# EAGLE design Root1 Interfaces Test (EAGLE 6.4)
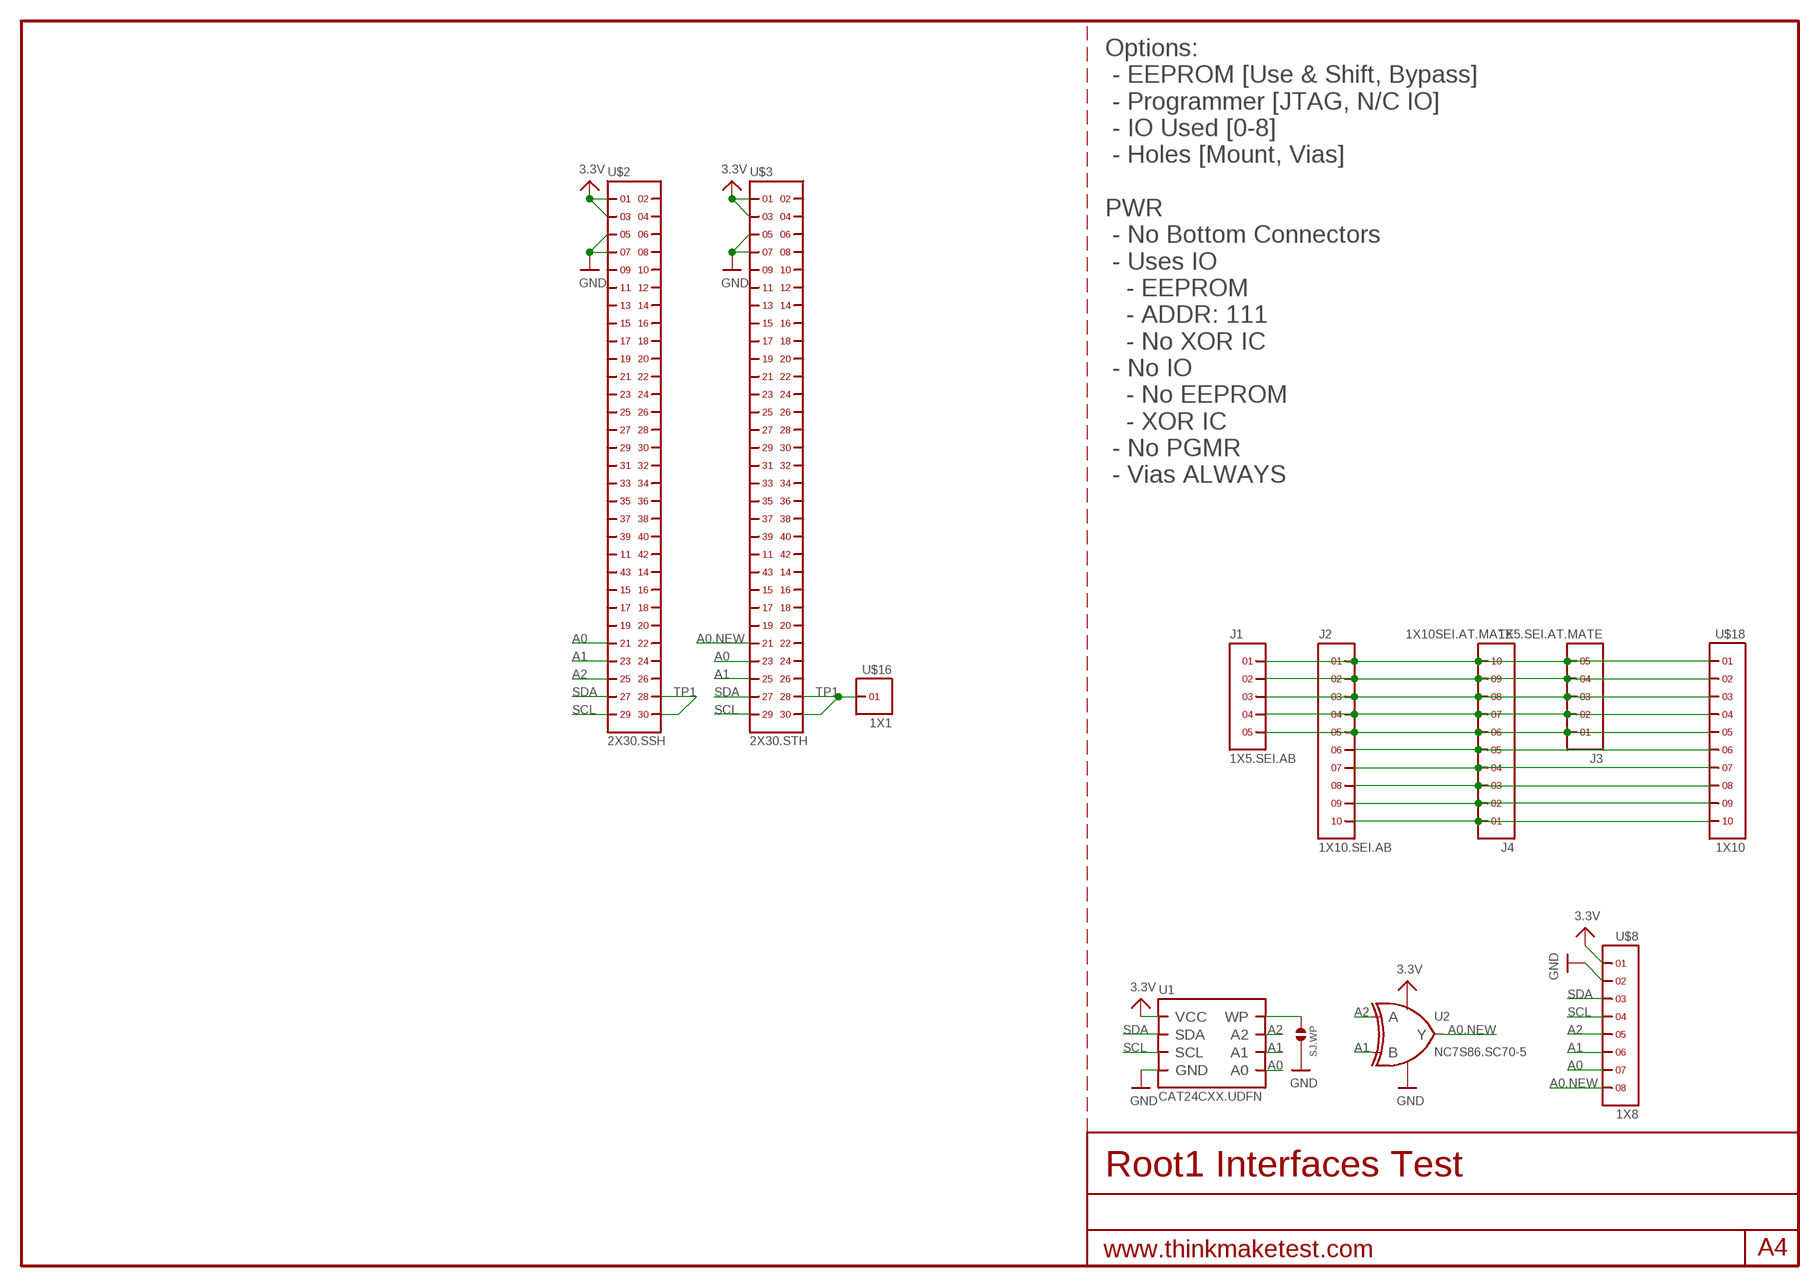
[diagram p0: schematic, sheet 1]

## Parts
J1  1X5.SEI.AB  [SEI-105-02-XX-S-X-AB]
J2  1X10.SEI.AB  [SEI-110-02-XX-S-X-AB]
J3  1X5.SEI.AT.MATE  [SEI-105-02-XX-S-AT.MATE]
J4  1X10SEI.AT.MATE  [SEI-110-02-XX-S-X-AT.MATE]
SJ.WP  SOLDERJUMPER.2.MED  [2.MED]
U1  CAT24CXX.UDFN  [UDFN8.2X3MM]
U2  NC7S86.SC70-5  [SC70-5]
U$2  2X30.SSH  [SSH-030-X.XX-X-D-A]
U$3  2X30.STH  [STH-030-X.XX-X-D-A]
U$8  1X8  [1X8]
U$16  1X1  [1X1]
U$18  1X10  [1X10]

## Nets
1: J1.1 J2.1 J3.5 J4.10 U$18.1
2: J1.2 J2.2 J3.4 J4.9 U$18.2
3: J1.3 J2.3 J3.3 J4.8 U$18.3
3.3V: U1.8(VCC) U2.6(VCC) U$2.1 U$2.3 U$3.1 U$3.3 U$8.1
4: J1.4 J2.4 J3.2 J4.7 U$18.4
5: J1.5 J2.5 J3.1 J4.6 U$18.5
6: J2.6 J4.5 U$18.6
7: J2.7 J4.4 U$18.7
8: J2.8 J4.3 U$18.8
9: J2.9 J4.2 U$18.9
10: J2.10 J4.1 U$18.10
A0: U1.1(A0) U$2.51 U$3.53 U$8.7
A0.NEW: U2.4(Y) U$3.51 U$8.8
A1: U1.2(A1) U2.2(B) U$2.53 U$3.55 U$8.6
A2: U1.3(A2) U2.1(A) U$2.55 U$8.5
GND: SJ.WP.2 U1.4(GND) U1.PAD(GND) U2.3(GND) U$2.5 U$2.7 U$3.5 U$3.7 U$8.2
N$1: SJ.WP.1 U1.7(WP)
SCL: U1.6(SCL) U$2.59 U$3.59 U$8.4
SDA: U1.5(SDA) U$2.57 U$3.57 U$8.3
TP1: U$2.58 U$2.60 U$3.58 U$3.60 U$16.1
Unconnected: U$2.2 U$2.4 U$2.6 U$2.8 U$2.9 U$2.10 U$2.11 U$2.12 U$2.13 U$2.14 U$2.15 U$2.16 U$2.17 U$2.18 U$2.19 U$2.20 U$2.21 U$2.22 U$2.23 U$2.24 U$2.25 U$2.26 U$2.27 U$2.28 U$2.29 U$2.30 U$2.31 U$2.32 U$2.33 U$2.34 U$2.35 U$2.36 U$2.37 U$2.38 U$2.39 U$2.40 U$2.41 U$2.42 U$2.43 U$2.44 U$2.45 U$2.46 U$2.47 U$2.48 U$2.49 U$2.50 U$2.52 U$2.54 U$2.56 U$3.2 U$3.4 U$3.6 U$3.8 U$3.9 U$3.10 U$3.11 U$3.12 U$3.13 U$3.14 U$3.15 U$3.16 U$3.17 U$3.18 U$3.19 U$3.20 U$3.21 U$3.22 U$3.23 U$3.24 U$3.25 U$3.26 U$3.27 U$3.28 U$3.29 U$3.30 U$3.31 U$3.32 U$3.33 U$3.34 U$3.35 U$3.36 U$3.37 U$3.38 U$3.39 U$3.40 U$3.41 U$3.42 U$3.43 U$3.44 U$3.45 U$3.46 U$3.47 U$3.48 U$3.49 U$3.50 U$3.52 U$3.54 U$3.56

## Notes on the sheet
- Options:
   - EEPROM [Use & Shift, Bypass]
   - Programmer [JTAG, N/C IO]
   - IO Used [0-8]
   - Holes [Mount, Vias]
- PWR
   - No Bottom Connectors
   - Uses IO
     - EEPROM
     - ADDR: 111
     - No XOR IC
   - No IO
     - No EEPROM
     - XOR IC
   - No PGMR
   - Vias ALWAYS

## Library data of the parts
J1 J3 = headers(1mm)(samtec):1X5
J2 J4 = headers(1mm)(samtec):1X10
SJ.WP = solderjumper:SOLDERJUMPER.2
U1 = on-semiconductor:CAT24CXX
U2 = fairchild:NC7S86
U$2 U$3 = headers(.5mm)(samtec):2X30
U$8 = headers(2mm)(samtec):1X8
U$16 = headers(2mm)(samtec):1X1
U$18 = headers(.1in):1X10

## Board
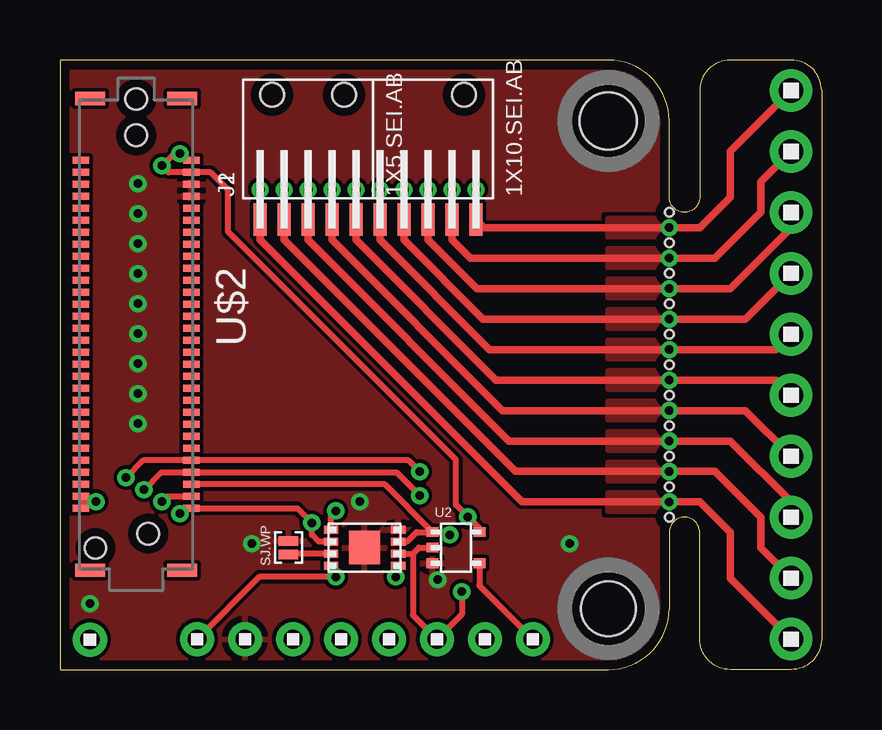
[diagram p1: board, top side]
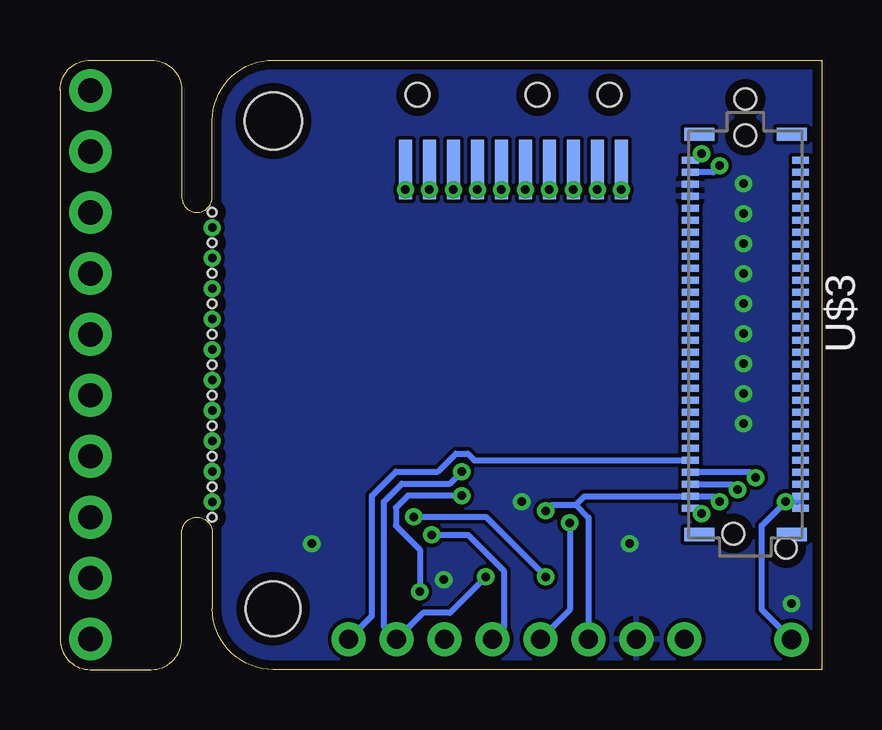
[diagram p2: board, bottom side, seen from below]

Size 31.75 x 25.4 mm. Coordinates in mm from the lower left corner, seen from the top.
Outline: 0,0 22.86,0 arc90 25.4,2.54 25.4,5.71 arc-90 26.04,6.35 arc-90 26.67,5.71 26.67,1.27 arc90 27.94,0 30.48,0 arc90 31.75,1.27 31.75,24.13 arc90 30.48,25.4 27.94,25.4 arc90 26.67,24.13 26.67,19.68 arc-90 26.04,19.05 arc-90 25.4,19.68 25.4,22.86 arc90 22.86,25.4 0,25.4 0,0
Copper layers (1*16): Top 0.0356mm / dielectric 1.5011mm / Bottom 0.0356mm
Design rules "OSHPark": minimum track width 6mil, minimum drill 13mil, track to track 6mil, track to pad 6mil, pad to pad 6mil, via to via 6mil, smd to smd 6mil, copper to edge 15mil, drill to drill 6mil, minimum pad ring 7mil, minimum via ring 7mil, stop-mask expansion 0mil, vias tented up to drill 16mil, thermal gap 10mil
Holes 2.29 mm at 22.86,2.54
Holes 2.39 mm at 22.86,22.86
Holes 0.36 mm at 25.4,8.89 25.4,7.62 25.4,6.35 25.4,10.16 25.4,11.43 25.4,12.7 25.4,13.97 25.4,15.24 25.4,16.51 25.4,17.78 25.4,19.05

### Footprints (pad centres in the part's own frame; a part is rotated, then mirrored left to right if it is on the bottom)
SEI-105-02-XX-S-X-AB = smd 0.559 x 1.346: 1 -2,-0.88; 2 -1,-0.88; 3 0,-0.879; 4 1,-0.88; 5 2,-0.88 | hole 0.99: -1.5,4.32; 1.5,4.32
SEI-110-02-XX-S-X-AB = smd 0.559 x 1.346: 1 -4.5,-0.88; 2 -3.5,-0.88; 3 -2.5,-0.879; 4 -1.5,-0.88; 5 -0.5,-0.88; 6 0.5,-0.88; 7 1.5,-0.88; 8 2.5,-0.879; 9 3.5,-0.88; 10 4.5,-0.88 | hole 0.99: -4,4.32; 4,4.32
SEI-105-02-XX-S-AT.MATE = smd 0.56 x 2.477: 1 -2,1.2; 2 -1,1.2; 3 0,1.2; 4 1,1.2; 5 2,1.2 | hole 0.99: -1.5,4.32; 1.5,4.32
SEI-110-02-XX-S-X-AT.MATE = smd 0.56 x 2.477: 1 -4.5,1.2; 2 -3.5,1.2; 3 -2.5,1.2; 4 -1.5,1.2; 5 -0.5,1.2; 6 0.5,1.2; 7 1.5,1.2; 8 2.5,1.2; 9 3.5,1.2; 10 4.5,1.2 | hole 0.99: -4,4.32; 4,4.32
2.MED = smd 0.406 x 0.813: 1 -0.279,0; 2 0.279,0
UDFN8.2X3MM = smd 0.32 x 0.6: 1 -0.75,-1.4; 2 -0.25,-1.4; 3 0.25,-1.4; 4 0.75,-1.4; 5 0.75,1.4; 6 0.25,1.4; 7 -0.25,1.4; 8 -0.75,1.4 | smd 1.4 x 1.3: PAD 0,0
SC70-5 = smd 0.4 x 0.5: 1 -0.65,-0.975; 2 0,-0.975; 3 0.65,-0.975; 4 0.65,0.975; 6 -0.65,0.975
SSH-030-X.XX-X-D-A = smd 0.3 x 0.7: 1 -7.25,2.3; 2 -7.25,-2.3; 3 -6.75,2.3; 4 -6.75,-2.3; 5 -6.25,2.3; 6 -6.25,-2.3; 7 -5.75,2.3; 8 -5.75,-2.3; 9 -5.25,2.3; 10 -5.25,-2.3; 11 -4.75,2.3; 12 -4.75,-2.3; 13 -4.25,2.3; 14 -4.25,-2.3; 15 -3.75,2.3; 16 -3.75,-2.3; 17 -3.25,2.3; 18 -3.25,-2.3; 19 -2.75,2.3; 20 -2.75,-2.3; 21 -2.25,2.3; 22 -2.25,-2.3; 23 -1.75,2.3; 24 -1.75,-2.3; 25 -1.25,2.3; 26 -1.25,-2.3; 27 -0.75,2.3; 28 -0.75,-2.3; 29 -0.25,2.3; 30 -0.25,-2.3; 31 0.25,2.3; 32 0.25,-2.3; 33 0.75,2.3; 34 0.75,-2.3; 35 1.25,2.3; 36 1.25,-2.3; 37 1.75,2.3; 38 1.75,-2.3; 39 2.25,2.3; 40 2.25,-2.3; 41 2.75,2.3; 42 2.75,-2.3; 43 3.25,2.3; 44 3.25,-2.3; 45 3.75,2.3; 46 3.75,-2.3; 47 4.25,2.3; 48 4.25,-2.3; 49 4.75,2.3; 50 4.75,-2.3; 51 5.25,2.3; 52 5.25,-2.3; 53 5.75,2.3; 54 5.75,-2.3; 55 6.25,2.3; 56 6.25,-2.3; 57 6.75,2.3; 58 6.75,-2.3; 59 7.25,2.3; 60 7.25,-2.3 | smd 0.55 x 1.25: PAD@1 -9.83,1.925; PAD@2 -9.83,-1.925; PAD@3 9.83,1.925; PAD@4 9.83,-1.925 | hole 0.89: -9.8,0; 8.9,-1.7
STH-030-X.XX-X-D-A = smd 0.3 x 0.7: 1 -7.25,-2.3; 2 -7.25,2.3; 3 -6.75,-2.3; 4 -6.75,2.3; 5 -6.25,-2.3; 6 -6.25,2.3; 7 -5.75,-2.3; 8 -5.75,2.3; 9 -5.25,-2.3; 10 -5.25,2.3; 11 -4.75,-2.3; 12 -4.75,2.3; 13 -4.25,-2.3; 14 -4.25,2.3; 15 -3.75,-2.3; 16 -3.75,2.3; 17 -3.25,-2.3; 18 -3.25,2.3; 19 -2.75,-2.3; 20 -2.75,2.3; 21 -2.25,-2.3; 22 -2.25,2.3; 23 -1.75,-2.3; 24 -1.75,2.3; 25 -1.25,-2.3; 26 -1.25,2.3; 27 -0.75,-2.3; 28 -0.75,2.3; 29 -0.25,-2.3; 30 -0.25,2.3; 31 0.25,-2.3; 32 0.25,2.3; 33 0.75,-2.3; 34 0.75,2.3; 35 1.25,-2.3; 36 1.25,2.3; 37 1.75,-2.3; 38 1.75,2.3; 39 2.25,-2.3; 40 2.25,2.3; 41 2.75,-2.3; 42 2.75,2.3; 43 3.25,-2.3; 44 3.25,2.3; 45 3.75,-2.3; 46 3.75,2.3; 47 4.25,-2.3; 48 4.25,2.3; 49 4.75,-2.3; 50 4.75,2.3; 51 5.25,-2.3; 52 5.25,2.3; 53 5.75,-2.3; 54 5.75,2.3; 55 6.25,-2.3; 56 6.25,2.3; 57 6.75,-2.3; 58 6.75,2.3; 59 7.25,-2.3; 60 7.25,2.3 | smd 0.55 x 1.25: PAD@1 -8.34,1.925; PAD@2 -8.34,-1.925; PAD@3 8.34,1.925; PAD@4 8.34,-1.925 | hole 0.9: 8.3,-0.5; -8.3,0
1X8 = drill 0.8 pad 1.422: 1 0,0; 2 2,0; 3 4,0; 4 6,0; 5 8,0; 6 10,0; 7 12,0; 8 14,0
1X1 = drill 0.8 pad 1.422: 1 0,0
1X10 = drill 1.016 pad 1.778: 1 0,0; 2 2.54,0; 3 5.08,0; 4 7.62,0; 5 10.16,0; 6 12.7,0; 7 15.24,0; 8 17.78,0; 9 20.32,0; 10 22.86,0

### Placement (x,y rotation side)
J1  10.35,19.64 0 top
J2  12.85,19.64 0 top
J3  10.35,19.64 0 bottom
J4  12.85,19.64 0 bottom
SJ.WP  9.53,5.08 90 top
U1  12.7,5.08 90 top
U2  16.51,5.08 270 top
U$2  3.17,13.97 270 top
U$3  3.17,13.97 270 bottom
U$8  5.71,1.27 0 top
U$16  1.25,1.25 0 top
U$18  30.48,1.27 90 top

### Tracks (layer width: path | path; a pad name or v marks a point on that pad's centre or on a via)
1  (via drill 0.36)
  Top 0.254: J2.1 v8.35,20
  Top 0.305: J2.1 8.35,17.91 19.27,6.99 v25.4,6.99 26.04,6.99 26.67,6.99 27.94,5.71 27.94,3.81 U$18.1
  Bottom 0.254: v8.35,20 J3.5
  pour Top: 22.86,7.37 25.4,7.37 25.4,6.6 22.86,6.6
2  (via drill 0.36)
  Top 0.254: J2.2 v9.35,20
  Top 0.305: J2.2 9.35,17.91 19,8.26 v25.4,8.26 26.04,8.26 27.3,8.26 29.21,6.35 29.21,5.08 U$18.2
  Bottom 0.254: v9.35,20 J4.9
  pour Top: 22.86,8.64 25.4,8.64 25.4,7.87 22.86,7.87
3  (via drill 0.36)
  Top 0.254: J2.3 v10.35,20
  Top 0.305: J2.3 10.35,17.91 18.73,9.53 v25.4,9.53 26.04,9.53 27.94,9.53 30.48,6.99 U$18.3
  Bottom 0.254: v10.35,20 J3.3
  pour Top: 22.86,9.91 25.4,9.91 25.4,9.14 22.86,9.14
3.3V  (via drill 0.36)
  Top 0.254: U2.6 17.48,5.88 v17,6.37 16.5,6.87 16.5,8.75 7,18.25 7,20 6.28,20.72 U$2.3 4.53,20.72 v4.25,21 4.75,21.5 v5,21.5 5.28,21.22 U$2.1 | U$8.1 8.31,3.87 v11.5,3.87 11.3,4.07 U1.8
  Bottom 0.254: v17,6.37 14,6.37 v11.5,3.87 | v5,21.5 5.28,21.22 U$2.1 | v4.25,21 4.53,20.72 U$2.3
4  (via drill 0.36)
  Top 0.254: J2.4 v11.35,20
  Top 0.305: J2.4 11.35,17.91 18.45,10.79 v25.4,10.79 26.67,10.79 28.57,10.79 U$18.4
  Bottom 0.254: v11.35,20 J4.7
  pour Top: 22.86,11.18 25.4,11.18 25.4,10.41 22.86,10.41
5  (via drill 0.36)
  Top 0.254: J2.5 v12.35,20
  Top 0.305: J2.5 12.35,17.91 18.18,12.06 v25.4,12.06 26.04,12.06 29.84,12.06 U$18.5
  Bottom 0.254: v12.35,20 J3.1
  pour Top: 22.86,12.45 25.4,12.45 25.4,11.68 22.86,11.68
6  (via drill 0.36)
  Top 0.254: J2.6 v13.35,20
  Top 0.305: J2.6 13.35,17.91 17.91,13.34 v25.4,13.34 29.21,13.34 29.84,13.34 U$18.6
  Bottom 0.254: v13.35,20 J4.5
  pour Top: 22.86,13.72 25.4,13.72 25.4,12.95 22.86,12.95
7  (via drill 0.36)
  Top 0.254: J2.7 v14.35,20
  Top 0.305: J2.7 14.35,17.91 17.64,14.61 v25.4,14.61 27.94,14.61 28.57,14.61 U$18.7
  Bottom 0.254: v14.35,20 J4.4
  pour Top: 22.86,14.99 25.4,14.99 25.4,14.22 22.86,14.22
8  (via drill 0.36)
  Top 0.254: J2.8 v15.35,20
  Top 0.305: J2.8 15.35,17.91 17.38,15.88 v25.4,15.88 27.3,15.88 27.94,15.88 30.48,18.41 U$18.8
  Bottom 0.254: v15.35,20 J4.3
  pour Top: 22.86,16.26 25.4,16.26 25.4,15.49 22.86,15.49
9  (via drill 0.36)
  Top 0.254: J2.9 v16.34,20
  Top 0.305: J2.9 16.34,17.91 17.11,17.14 v25.4,17.14 26.67,17.14 27.3,17.14 29.21,19.05 29.21,20.32 U$18.9
  Bottom 0.254: v16.34,20 J4.2
  pour Top: 22.86,17.53 25.4,17.53 25.4,16.76 22.86,16.76
10  (via drill 0.36)
  Top 0.254: J2.10 v17.34,20
  Top 0.305: J2.10 17.68,18.41 v25.4,18.41 26.04,18.41 26.67,18.41 27.94,19.68 27.94,21.59 U$18.10
  Bottom 0.254: v17.34,20 J4.1
  pour Top: 22.86,18.8 25.4,18.8 25.4,18.03 22.86,18.03
A0  (via drill 0.36)
  Top 0.254: U1.1 14.1,3.96 v14,3.87 | v15,8.25 14.53,8.72 U$2.51 3.47,8.72 v2.75,8
  Bottom 0.254: v14,3.87 15.5,2.37 16.62,2.37 U$8.7 18.25,1.8 18.25,7 17.5,7.75 15.5,7.75 v15,8.25 | v2.75,8 2.97,8.22 U$3.53
A0.NEW
  Top 0.254: U2.4 17.48,3.5 U$8.8
  Bottom 0.254: U$8.8 18.75,2.23 18.75,7.25 17.75,8.25 16,8.25 15.25,9 14.75,9 14.47,8.72 U$3.51
A1  (via drill 0.36)
  Top 0.254: U1.2 14.71,4.83 | 14.71,4.83 14.96,5.08 U2.2 | 14.71,4.83 14.71,2.27 U$8.6 16.75,2.31 v16.75,3.25 | v3.5,7.5 4.22,8.22 U$2.53 14.03,8.22 v15,7.25
  Bottom 0.254: v15,7.25 17.25,7.25 17.75,6.75 17.75,6 16.75,5 v16.75,3.25 | U$3.55 3.72,7.72 v3.5,7.5
A2  (via drill 0.36)
  Top 0.254: U1.3 14.46,5.33 14.87,5.73 U2.1 | U2.1 16.14,5.73 v16.25,5.62 | U2.1 13.54,7.72 U$2.55
  Bottom 0.254: v16.25,5.62 14.75,5.62 13.25,4.12 13.25,1.74 U$8.5
GND  (via drill 0.36)
  other vias: 12.5,7 15.75,3.75 3.25,20.25 3.25,19 3.25,17.75 3.25,16.5 3.25,15.25 3.25,14 3.25,12.75 3.25,11.5 3.25,10.25 1.25,2.75 8,5.25 21.25,5.25
  pour Bottom (rank 6): 0,0 31.75,0 31.75,25.4 0,25.4
  pour Top (rank 6): 0,0 31.75,0 31.75,25.4 0,25.4
N$1
  Top 0.254: U1.7 9.55,4.83 SJ.WP.1
SCL  (via drill 0.36)
  Top 0.254: U1.6 10.79,5.33 10.5,5.62 v10.5,6.12 9.89,6.72 U$3.59 5.22,6.72 v5,6.5
  Bottom 0.254: v10.5,6.12 10.5,2.48 U$8.4 | v5,6.5 5.22,6.72 U$3.59
SDA  (via drill 0.36)
  Top 0.254: U1.5 11.3,6.42 v11.5,6.62 | v4.25,7 4.47,7.22 U$3.57
  Bottom 0.254: v11.5,6.62 11.25,6.87 10.25,6.87 | 10.25,6.87 9.71,6.33 U$8.3 | v4.25,7 4.47,7.22 U$3.57 9.89,7.22 10.25,6.87
TP1  (via drill 0.36)
  Top 0.254: U$2.60 U$2.58 1.09,7 v1.5,7
  Bottom 0.254: U$2.60 U$2.58 1.09,7 v1.5,7 2.5,6 2.5,2.5 U$16.1

### Text on the board
tDocu: 10 | 9 | 8 | 7 | 6 | 5 | 4 | 3 | 2 | 3.3v | GND | SDA | SCL | A2 | A1 | A0 | A0.NEW | TP1 | 1
bDocu: 10 | 9 | 8 | 7 | 6 | Cruz Monrreal II | AnomalousMaker.com | 5 | 4 | 3 | 2 | 3.3v | GND | SDA | SCL | A2 | A1 | A0 | A0.NEW | TP1 | 1